# EAGLE design SMS with FM to Genesis INTEGRATED (EAGLE 6.5.0)
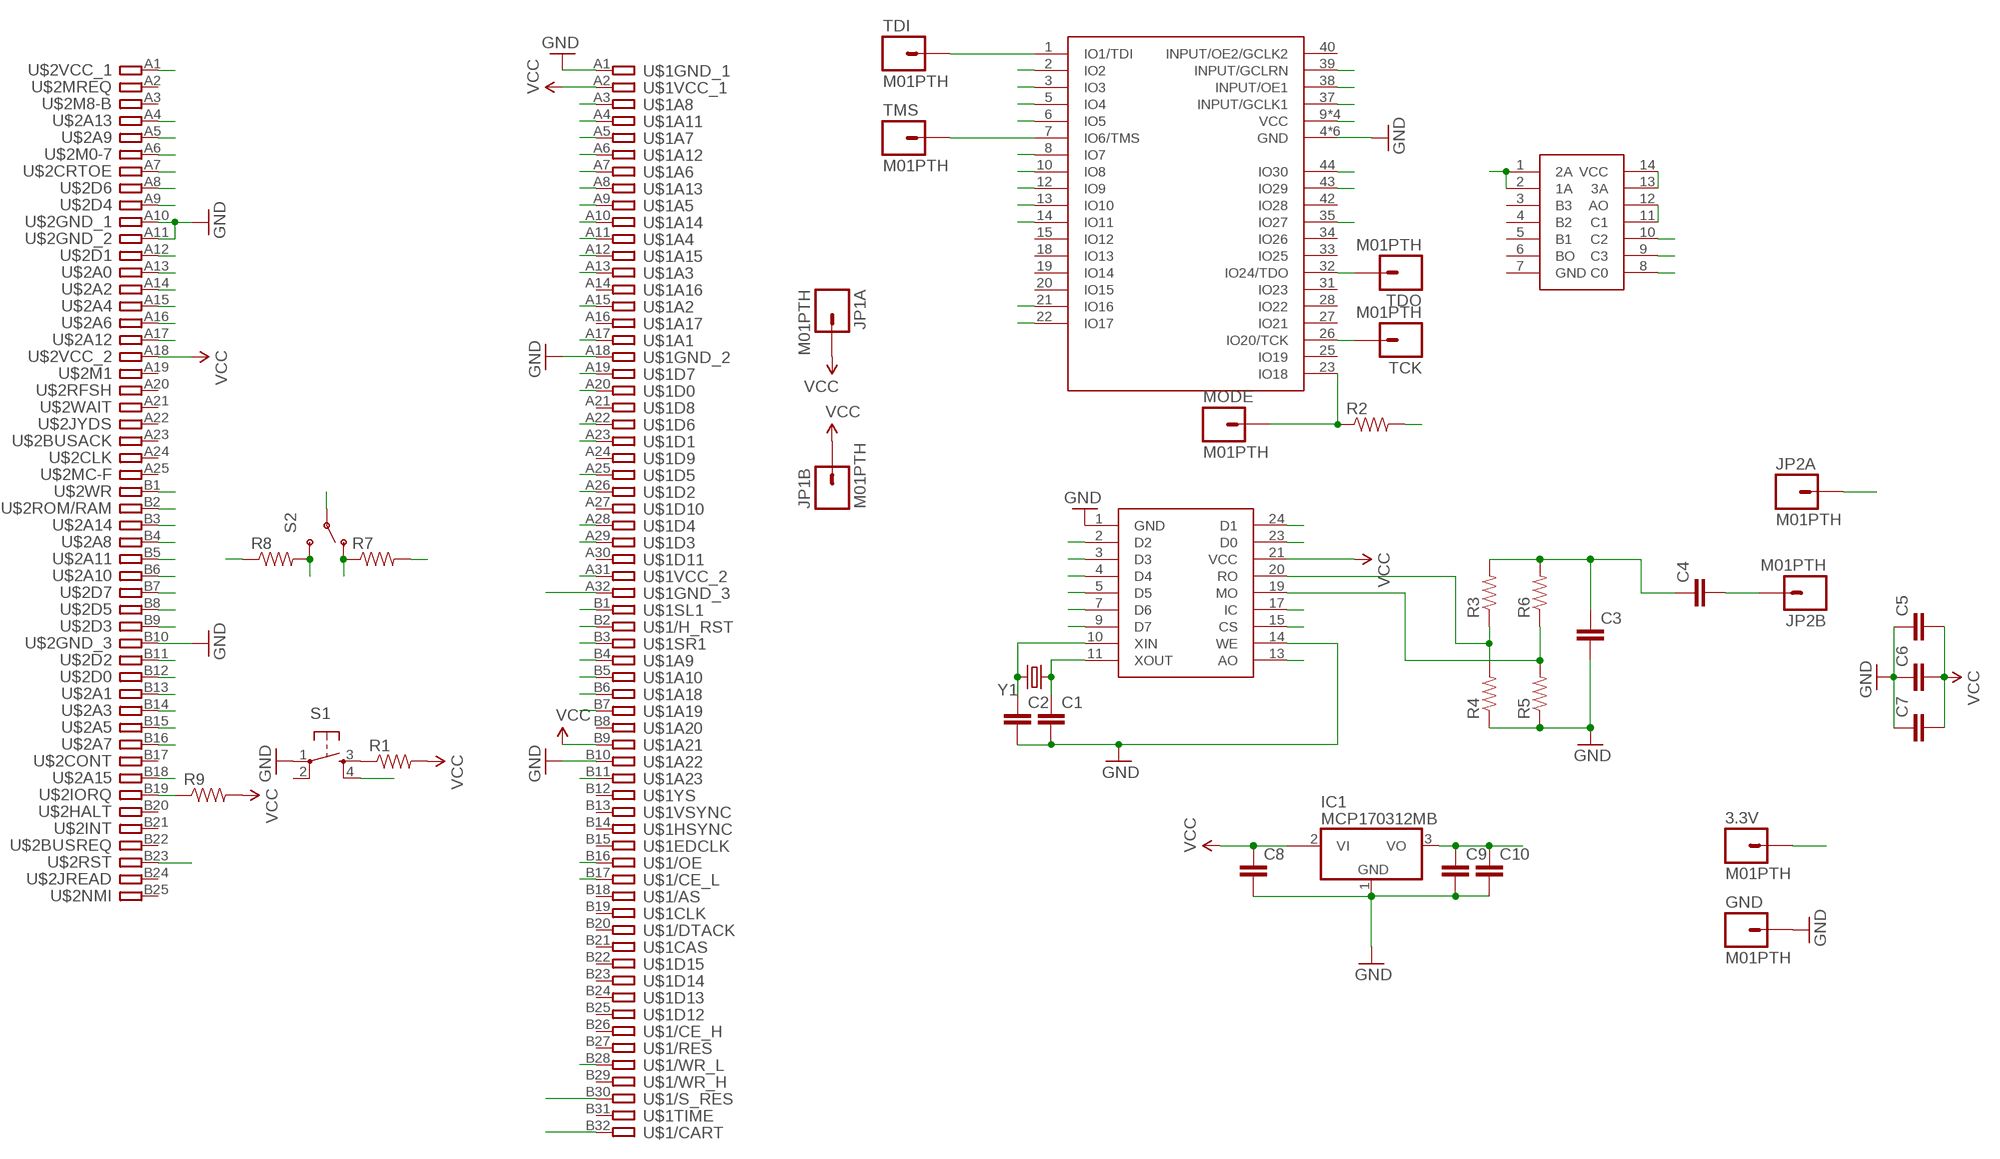
[diagram p0: schematic, sheet 1]

## Parts
3.3V  M01PTH  [1X01]
C1  CAP0805  [0805]
C2  CAP0805  [0805]
C3  CAP0805  [0805]
C4  CAP0805  [0805]
C5  CAP0805  [0805]
C6  CAP0805  [0805]
C7  CAP0805  [0805]
C8  CAP1206  [1206]
C9  CAP0805  [0805]
C10  CAP0805  [0805]
GND  M01PTH  [1X01]
IC1  MCP170312MB  [SOT89]
IC2  YM2413BSOIC24W  [SO24W]
IC3  74LS10SOIC14  [SO14]
JP1A  M01PTH  [1X01]
JP1B  M01PTH  [1X01]
JP2A  M01PTH  [1X01]
JP2B  M01PTH  [1X01]
MODE  M01PTH  [1X01]
R1  RESISTOR0805-RES  [0805]
R2  RESISTOR0805-RES  [0805]
R3  RESISTOR0805-RES  [0805]
R4  RESISTOR0805-RES  [0805]
R5  RESISTOR0805-RES  [0805]
R6  RESISTOR0805-RES  [0805]
R7  RESISTOR0805-RES  [0805]
R8  RESISTOR0805-RES  [0805]
R9  RESISTOR0805-RES  [0805]
S1  TAC_SWITCHSMD  [TACTILE-SWITCH-SMD]
S2  SWITCH-SPDTPTH  [SWITCH-SPDT]
TCK  M01PTH  [1X01]
TDI  M01PTH  [1X01]
TDO  M01PTH  [1X01]
TMS  M01PTH  [1X01]
U$1  GENESIS-LARGE  [GENESIS-LARGE]
U$2  SMS-R  [SMS]
U$4  EPM3032A  [TQFP44]
Y1  CRYSTALHC49US  [HC49US]

## Nets
3.3V: 3.3V.1 C9.1 C10.1 IC1.3(VO) R2.2 R7.2 R8.1 U$4.9(VCC) U$4.17(VCC) U$4.29(VCC) U$4.41(VCC)
A3: IC3.9(C3) U$1.A3 U$2.B16 U$4.44(IO30)
A4: U$1.A4 U$2.B6
A5: IC3.10(C2) U$1.A5 U$2.A16 U$4.3(IO3)
A6: U$1.A6 U$2.B5
A7: U$1.A7 U$2.B15
A8: U$1.A8 U$2.A17
A9: U$1.A9 U$2.A15
A10: U$1.A10 U$2.A4
A11: U$1.A11 U$2.B14
A12: U$1.A12 U$2.B3
A13: U$1.A13 U$2.A14 U$4.8(IO7)
A15: U$1.A15 U$2.B13 U$4.6(IO5)
A17: IC2.13(AO) U$1.A17 U$2.A13 U$4.14(IO11)
A19: IC2.9(D7) U$1.A19 U$2.B7
A20: IC2.23(D0) U$1.A20 U$2.B12 U$4.13(IO10)
A22: IC2.7(D6) U$1.A22 U$2.A8
A23: IC2.24(D1) U$1.A23 U$2.A12 U$4.12(IO9)
A25: IC2.5(D5) U$1.A25 U$2.B8
A26: IC2.2(D2) U$1.A26 U$2.B11 U$4.10(IO8)
A28: IC2.4(D4) U$1.A28 U$2.A9
A29: IC2.3(D3) U$1.A29 U$2.B9
A31: U$1.A31 U$2.A1
AUDOUT: JP2A.1 U$1.B1 U$1.B3
B2: U$1.B2
B4: U$1.B4 U$2.B4
B5: U$1.B5 U$2.A5
B6: U$1.B6 U$2.A7
B7: U$1.B7
B11: S1.4 U$1.B11
B16: U$1.B16 U$2.B2 U$4.5(IO4)
B17: U$1.B17 U$2.A6 U$2.B18
B28: U$1.B28 U$2.B1 U$4.2(IO2)
FM: R8.2 S2.3(S) U$4.35(IO27)
GND: C1.2 C2.2 C3.2 C5.1 C6.1 C7.1 C8.2 C9.2 C10.2 GND.1 IC1.1(GND) IC2.1(GND) IC2.14(WE) R4.1 R5.1 S1.1 U$1.A1 U$1.A18 U$1.B10 U$2.A10 U$2.A11 U$2.B10 U$4.4(GND) U$4.11(GND) U$4.16(GND) U$4.24(GND) U$4.30(GND) U$4.36(GND)
IORQ: IC3.1(2A) IC3.2(1A) R9.1 U$2.B19 U$4.43(IO29)
JPFM: R7.1 S2.1(O) U$4.37(INPUT/GCLK1)
KBSEL: IC3.8(C0) U$4.38(INPUT/OE1)
N$1: R1.1 S1.3
N$3: C2.1 IC2.10(XIN) Y1.2
N$4: C1.1 IC2.11(XOUT) Y1.1
N$5: TDI.1 U$4.1(IO1/TDI)
N$6: IC3.13(3A) IC3.14(VCC)
N$7: IC3.11(C1) IC3.12(AO)
N$8: TMS.1 U$4.7(IO6/TMS)
N$9: TDO.1 U$4.32(IO24/TDO)
N$10: TCK.1 U$4.26(IO20/TCK)
N$11: MODE.1 R2.1 U$4.23(IO18)
N$12: C3.1 C4.1 R3.2 R6.2
N$13: IC2.20(RO) R3.1 R4.2
N$14: IC2.19(MO) R5.2 R6.1
N$15: C4.2 JP2B.1
RST: U$2.B23 U$4.39(INPUT/GCLRN)
SMS: U$1.A32 U$1.B30 U$1.B32
TEMP: S2.2(P)
VCC: C5.2 C6.2 C7.2 C8.1 IC1.2@1(VI1) IC2.21(VCC) JP1A.1 JP1B.1 R1.2 R9.2 U$1.A2 U$1.B9 U$2.A18
YMCS: IC2.15(CS) U$4.22(IO17)
YMRESET: IC2.17(IC) U$4.21(IO16)
Unconnected: IC1.2(VI) IC3.3(B3) IC3.4(B2) IC3.5(B1) IC3.6(BO) S1.2 U$1.A14 U$1.A16 U$1.A21 U$1.A24 U$1.A27 U$1.A30 U$1.B8 U$1.B12 U$1.B13 U$1.B14 U$1.B15 U$1.B18 U$1.B19 U$1.B20 U$1.B21 U$1.B22 U$1.B23 U$1.B24 U$1.B25 U$1.B26 U$1.B27 U$1.B29 U$1.B31 U$2.A2 U$2.A3 U$2.A19 U$2.A20 U$2.A21 U$2.A22 U$2.A23 U$2.A24 U$2.A25 U$2.B17 U$2.B20 U$2.B21 U$2.B22 U$2.B24 U$2.B25 U$4.15(IO12) U$4.18(IO13) U$4.19(IO14) U$4.20(IO15) U$4.25(IO19) U$4.27(IO21) U$4.28(IO22) U$4.31(IO23) U$4.33(IO25) U$4.34(IO26) U$4.40(INPUT/OE2/GCLK2) U$4.42(IO28)

## Power pins joined to a net without a drawn wire
GND: IC3.7(GND)

## Library data of the parts
3.3V GND JP1A JP1B JP2A JP2B MODE TCK TDI TDO TMS = SparkFun-Connectors:M01: Header 1 Standard 1-pin 0.1" header. Use with straight break away headers (SKU : PRT-00116), right angle break away headers (PRT-00553), swiss pins (PRT-00743), machine pins (PRT-00117), and female headers (PRT-00115).
C1 C2 = SparkFun-Passives:CAP: Capacitor Standard 0603 ceramic capacitor, and 0.1" leaded capacitor.
C3-C10 = SparkFun-Capacitors:CAP: Capacitor Standard 0603 ceramic capacitor, and 0.1" leaded capacitor.
IC1 = linear:MCP1703*: 250 mA, 16V, Low Quiescent Current LDO Regulator Source: http://ww1.microchip.com/downloads/en/DeviceDoc/22049b.pdf
IC2 = linear:YM2413B
IC3 = linear:74LS10
R1-R9 = SparkFun-Passives:RESISTOR: Resistor Basic schematic elements and footprints for 0603, 1206, and PTH resistors.
S1 = SparkFun-Electromechanical:TAC_SWITCH: Momentary Switch Button commonly used for reset or general input. Spark Fun Electronics SKU : COM-00097 SMT- SWCH-08247
S2 = SparkFun-Electromechanical:SWITCH-SPDT: SPDT Switch Simple slide switch, Spark Fun Electronics SKU : COM-00102 DPDT SMT slide switch, AYZ0202, SWCH-08179
U$1 = genesis:GENESIS: Sega Genesis cartridge connector
U$2 = sms:SMS-R: Sega Master System cartridge connector, reversed
U$4 = linear:EPM3032A
Y1 = SparkFun-FreqCtrl:CRYSTAL: Various standard crystals. Proven footprints. Spark Fun Electronics SKU : COM-00534

## Board
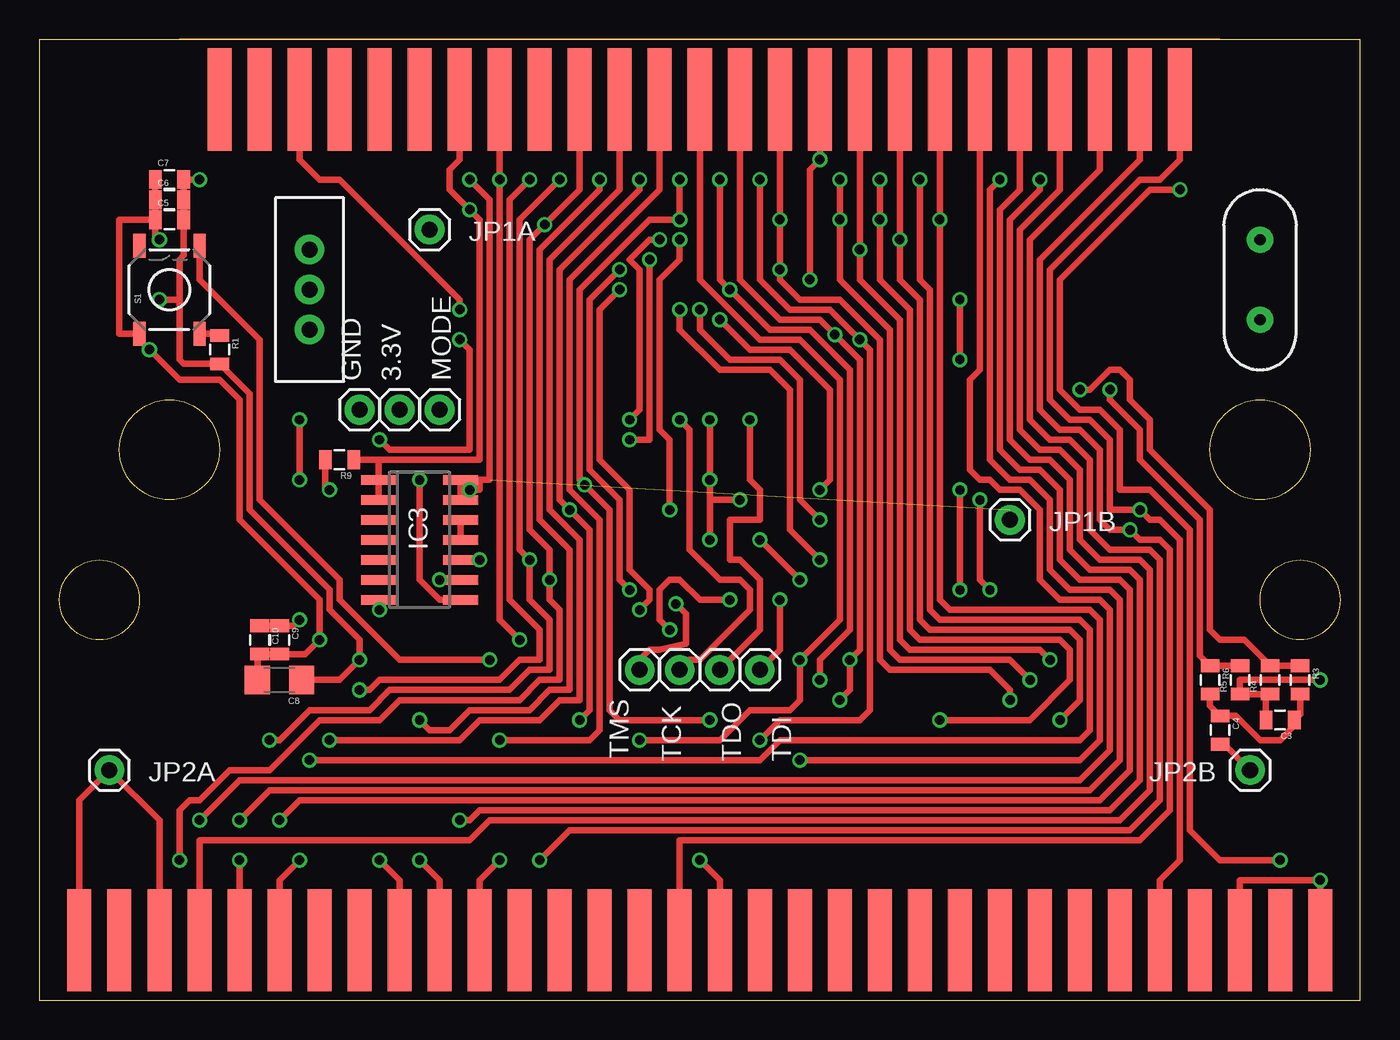
[diagram p1: board, top side]
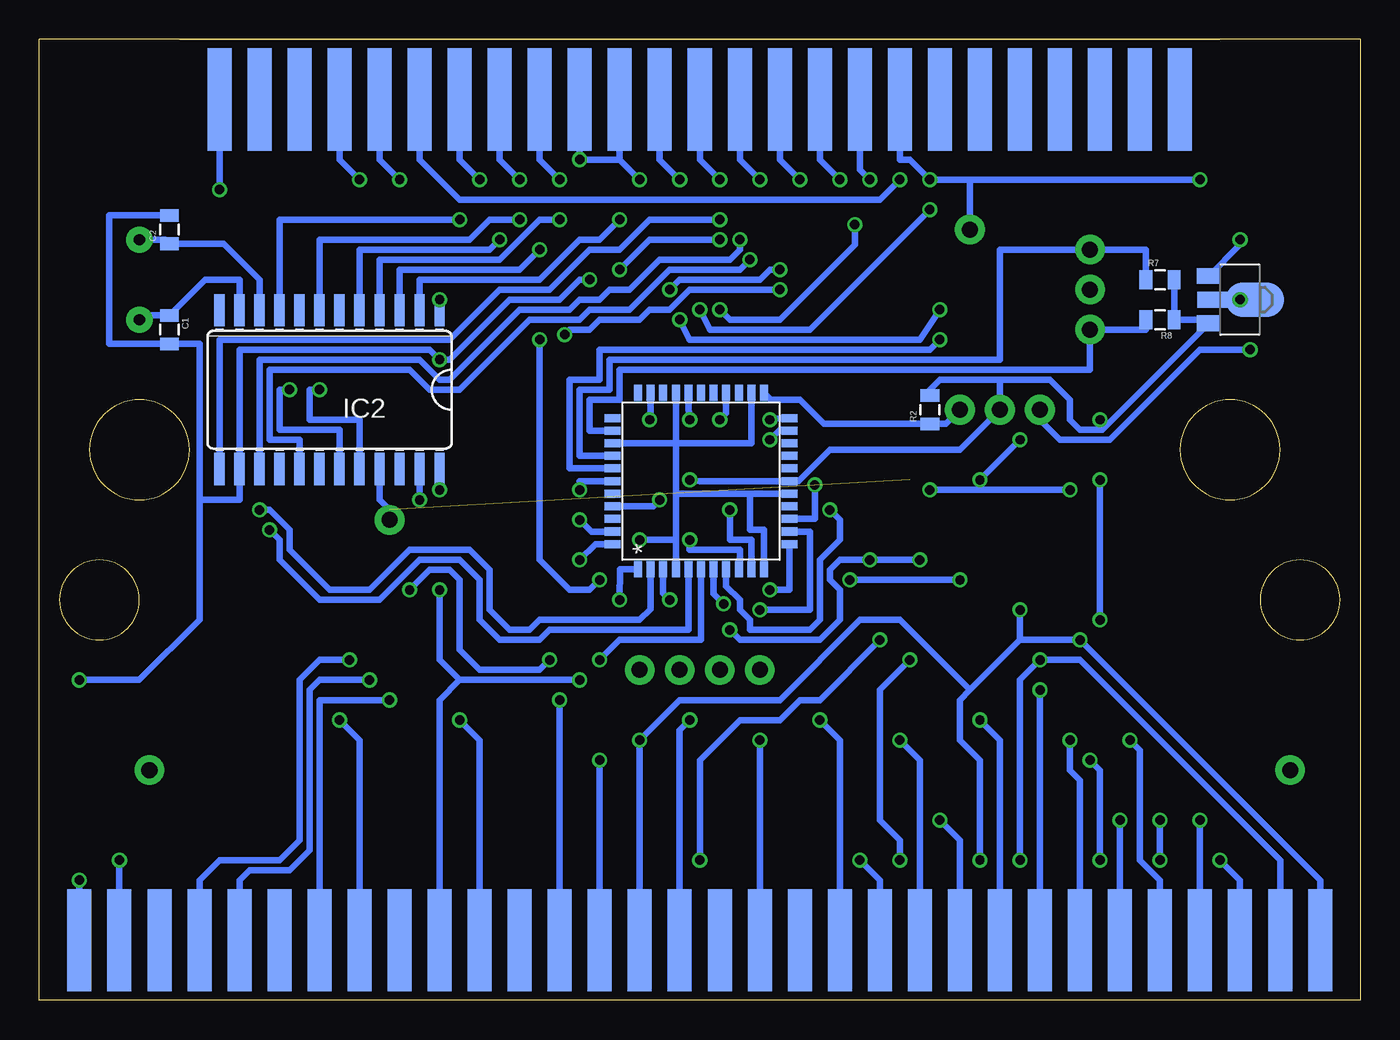
[diagram p2: board, bottom side, seen from below]

Size 83.82 x 60.96 mm. Coordinates in mm from the lower left corner, seen from the top.
Copper layers (1*16): Top 0.0356mm / dielectric 1.5011mm / Bottom 0.0356mm
Design rules "OSHPark": minimum track width 6mil, minimum drill 13mil, track to track 6mil, track to pad 6mil, pad to pad 6mil, via to via 6mil, smd to smd 6mil, copper to edge 15mil, drill to drill 6mil, minimum pad ring 7mil, minimum via ring 7mil, stop-mask expansion 3mil, vias tented up to drill 0mil, thermal gap 10mil

### Footprints (pad centres in the part's own frame; a part is rotated, then mirrored left to right if it is on the bottom)
1X01 = drill 1.016 pad 1.88: 1 0,0
0805 = smd 0.8 x 1.2: 1 -0.9,0; 2 0.9,0
1206 = smd 1.6 x 1.8: 1 -1.4,0; 2 1.4,0
SOT89 = smd 1 x 1.5: 1 -1.499,-1.981; 3 1.499,-1.981 | smd 1 x 2: 2 0,-1.727 | smd 2.2 x 3.7: 2@1 0,0.94
SO24W = smd 0.66 x 2.032: 1 -6.985,-5.029; 2 -5.715,-5.029; 3 -4.445,-5.029; 4 -3.175,-5.029; 5 -1.905,-5.029; 6 -0.635,-5.029; 7 0.635,-5.029; 8 1.905,-5.029; 9 3.175,-5.029; 10 4.445,-5.029; 11 5.715,-5.029; 12 6.985,-5.029; 13 6.985,5.029; 14 5.715,5.029; 15 4.445,5.029; 16 3.175,5.029; 17 1.905,5.029; 18 0.635,5.029; 19 -0.635,5.029; 20 -1.905,5.029; 21 -3.175,5.029; 22 -4.445,5.029; 23 -5.715,5.029; 24 -6.985,5.029
SO14 = smd 0.6 x 2.2: 1 -3.81,-2.6; 2 -2.54,-2.6; 3 -1.27,-2.6; 4 0,-2.6; 5 1.27,-2.6; 6 2.54,-2.6; 7 3.81,-2.6; 8 3.81,2.6; 9 2.54,2.6; 10 1.27,2.6; 11 0,2.6; 12 -1.27,2.6; 13 -2.54,2.6; 14 -3.81,2.6
TACTILE-SWITCH-SMD = smd 1.524 x 0.762: 1 -2.794,1.905; 2 2.794,1.905; 3 -2.794,-1.905; 4 2.794,-1.905
SWITCH-SPDT = drill 1.016 pad 1.88: 1 0,2.54; 2 0,0; 3 0,-2.54
GENESIS-LARGE = smd 1.524 x 6.477 bottom: A1 2.54,3.81; A2 5.08,3.81; A3 7.62,3.81; A4 10.16,3.81; A5 12.7,3.81; A6 15.24,3.81; A7 17.78,3.81; A8 20.32,3.81; A9 22.86,3.81; A10 25.4,3.81; A11 27.94,3.81; A12 30.48,3.81; A13 33.02,3.81; A14 35.56,3.81; A15 38.1,3.81; A16 40.64,3.81; A17 43.18,3.81; A18 45.72,3.81; A19 48.26,3.81; A20 50.8,3.81; A21 53.34,3.81; A22 55.88,3.81; A23 58.42,3.81; A24 60.96,3.81; A25 63.5,3.81; A26 66.04,3.81; A27 68.58,3.81; A28 71.12,3.81; A29 73.66,3.81; A30 76.2,3.81; A31 78.74,3.81; A32 81.28,3.81 | smd 1.524 x 6.477: B1 2.54,3.81; B2 5.08,3.81; B3 7.62,3.81; B4 10.16,3.81; B5 12.7,3.81; B6 15.24,3.81; B7 17.78,3.81; B8 20.32,3.81; B9 22.86,3.81; B10 25.4,3.81; B11 27.94,3.81; B12 30.48,3.81; B13 33.02,3.81; B14 35.56,3.81; B15 38.1,3.81; B16 40.64,3.81; B17 43.18,3.81; B18 45.72,3.81; B19 48.26,3.81; B20 50.8,3.81; B21 53.34,3.81; B22 55.88,3.81; B23 58.42,3.81; B24 60.96,3.81; B25 63.5,3.81; B26 66.04,3.81; B27 68.58,3.81; B28 71.12,3.81; B29 73.66,3.81; B30 76.2,3.81; B31 78.74,3.81; B32 81.28,3.81
SMS = smd 1.524 x 6.477 bottom: A1 2.54,3.81; A2 5.08,3.81; A3 7.62,3.81; A4 10.16,3.81; A5 12.7,3.81; A6 15.24,3.81; A7 17.78,3.81; A8 20.32,3.81; A9 22.86,3.81; A10 25.4,3.81; A11 27.94,3.81; A12 30.48,3.81; A13 33.02,3.81; A14 35.56,3.81; A15 38.1,3.81; A16 40.64,3.81; A17 43.18,3.81; A18 45.72,3.81; A19 48.26,3.81; A20 50.8,3.81; A21 53.34,3.81; A22 55.88,3.81; A23 58.42,3.81; A24 60.96,3.81; A25 63.5,3.81 | smd 1.524 x 6.477: B1 2.54,3.81; B2 5.08,3.81; B3 7.62,3.81; B4 10.16,3.81; B5 12.7,3.81; B6 15.24,3.81; B7 17.78,3.81; B8 20.32,3.81; B9 22.86,3.81; B10 25.4,3.81; B11 27.94,3.81; B12 30.48,3.81; B13 33.02,3.81; B14 35.56,3.81; B15 38.1,3.81; B16 40.64,3.81; B17 43.18,3.81; B18 45.72,3.81; B19 48.26,3.81; B20 50.8,3.81; B21 53.34,3.81; B22 55.88,3.81; B23 58.42,3.81; B24 60.96,3.81; B25 63.5,3.81
TQFP44 = smd 1.016 x 0.508: 1 -0.6,9; 2 -0.6,8.2; 3 -0.6,7.4; 4 -0.6,6.6; 5 -0.6,5.8; 6 -0.6,5; 7 -0.6,4.2; 8 -0.6,3.4; 9 -0.6,2.6; 10 -0.6,1.8; 11 -0.6,1; 23 10.6,1; 24 10.6,1.8; 25 10.6,2.6; 26 10.6,3.4; 27 10.6,4.2; 28 10.6,5; 29 10.6,5.8; 30 10.6,6.6; 31 10.6,7.4; 32 10.6,8.2; 33 10.6,9 | smd 0.508 x 1.016: 12 1,-0.6; 13 1.8,-0.6; 14 2.6,-0.6; 15 3.4,-0.6; 16 4.2,-0.6; 17 5,-0.6; 18 5.8,-0.6; 19 6.6,-0.6; 20 7.4,-0.6; 21 8.2,-0.6; 22 9,-0.6; 34 9,10.6; 35 8.2,10.6; 36 7.4,10.6; 37 6.6,10.6; 38 5.8,10.6; 39 5,10.6; 40 4.2,10.6; 41 3.4,10.6; 42 2.6,10.6; 43 1.8,10.6; 44 1,10.6
HC49US = drill 0.7 pad 1.651: 1 -2.54,0; 2 2.54,0

### Placement (x,y rotation side)
3.3V  22.86,37.47 0 top
C1  75.56,42.55 270 bottom
C2  75.56,48.9 90 bottom
C3  78.74,17.78 180 top
C4  74.93,17.14 270 top
C5  8.26,49.53 0 top
C6  8.26,50.8 0 top
C7  8.26,52.07 0 top
C8  15.24,20.32 180 top
C9  15.24,22.86 270 top
C10  13.97,22.86 270 top
GND  20.32,37.47 0 top
IC1  7.62,44.45 270 bottom
IC2  65.41,38.73 180 bottom
IC3  24.13,29.21 270 top
JP1A  24.77,48.9 0 top
JP1B  61.59,30.48 0 top
JP2A  4.45,14.61 270 top
JP2B  76.83,14.61 0 top
MODE  25.4,37.47 90 top
R1  11.43,41.27 270 top
R2  27.3,37.47 90 bottom
R3  80.01,20.32 270 top
R4  78.11,20.32 90 top
R5  76.2,20.32 90 top
R6  74.3,20.32 270 top
R7  12.7,45.72 0 bottom
R8  12.7,43.18 180 bottom
R9  19.05,34.29 180 top
S1  8.26,45.09 90 top
S2  17.14,45.09 0 top
TCK  40.64,20.95 0 top
TDI  45.72,20.95 0 top
TDO  43.18,20.95 0 top
TMS  38.1,20.95 0 top
U$1  0,0 0 top
U$2  74.93,60.96 180 top
U$4  36.83,27.94 90 bottom
Y1  77.47,45.72 90 top

### Tracks (layer width: path | path; a pad name or v marks a point on that pad's centre or on a via)
3.3V  (via drill 0.6)
  Top 0.406: v42.55,36.83 v42.55,33.02 | v42.55,33.02 v42.55,29.21 | v42.55,33.02 42.55,31.75 v44.45,31.75 | C10.1 C9.1 16.14,23.76 v16.51,24.13 | v16.51,33.02 v16.51,36.83
  Bottom 0.406: v42.55,36.83 42.63,37.55 U$4.29 | U$4.9 39.43,27.88 39.37,27.94 39.37,28.57 42.55,28.57 v42.55,29.21 | v42.55,33.02 41.91,32.94 U$4.17 35.64,32.94 33.66,34.92 25.4,34.92 3.3V.1 22.86,39.37 | U$4.41 44.86,31.34 v44.45,31.75 | 22.86,39.37 26.67,39.37 27.3,38.73 R2.2 | 16.12,36.44 16.36,36.2 17.78,36.2 18.41,36.83 18.41,38.1 19.68,39.37 22.86,39.37 | 16.12,36.44 IC1.3 9.6,43.18 R8.1 R7.2 | v16.51,24.13 v16.51,33.02 | v16.51,36.83 16.12,36.44
A3  (via drill 0.6)
  Top 0.406: v8.89,8.89 8.89,12.06 9.53,12.7 10.16,12.7 12.06,14.61 14.61,14.61 17.78,17.78 21.59,17.78 22.86,19.05 30.48,19.05 31.75,20.32 33.02,20.32 33.02,24.77 32.38,25.4 v32.38,26.67 32.38,28.57 31.11,29.84 31.11,48.26 v32.07,49.21 34.29,51.44 U$2.B16 | v25.4,26.67 IC3.9 | v49.53,27.94 47.62,29.84 47.62,38.73 46.35,40.01 43.18,40.01 40.64,42.55 v40.64,43.81
  Bottom 0.406: v8.89,8.89 7.62,7.62 U$1.A3 | v32.38,26.67 v25.4,26.67 | U$4.44 48.53,28.94 v49.53,27.94 | v40.64,43.81 40.01,43.18 36.83,43.18 32.07,47.94 v32.07,49.21
A4  (via drill 0.6)
  Top 0.406: v10.16,11.43 12.7,13.97 66.04,13.97 67.94,15.88 67.94,24.77 67.31,25.4 64.77,25.4 63.5,26.67 63.5,31.11 62.23,32.38 60.96,32.38 60.33,33.02 59.69,33.02 59.05,33.66 59.05,39.37 59.69,40.01 U$2.B6
  Bottom 0.406: v10.16,11.43 U$1.A4
A5  (via drill 0.6)
  Top 0.406: v14.61,16.51 15.24,16.51 17.14,18.41 20.95,18.41 22.23,19.68 29.84,19.68 31.11,20.95 32.38,20.95 32.38,24.13 31.11,25.4 v31.11,27.94 30.48,28.57 30.48,49.53 v33.02,52.07 | v27.94,27.94 IC3.10 | v43.81,25.4 41.91,25.4 40.64,26.67 40.01,26.67 39.37,26.04 39.37,24.13 v40.01,23.5
  Bottom 0.406: U$2.A16 34.29,53.34 v33.02,52.07 | v14.61,16.51 13.97,15.88 13.97,8.89 12.7,7.62 U$1.A5 | v27.94,27.94 v31.11,27.94 33.02,27.94 33.66,27.3 33.66,26.67 33.02,26.04 33.02,24.13 34.29,22.86 39.37,22.86 v40.01,23.5 | U$4.3 44.23,25.82 v43.81,25.4
A6  (via drill 0.6)
  Top 0.406: v15.24,11.43 16.51,12.7 67.31,12.7 69.22,14.61 69.22,26.04 68.58,26.67 66.04,26.67 64.77,27.94 64.77,32.38 63.5,33.66 62.23,33.66 60.96,34.92 60.96,50.16 62.23,51.44 U$2.B5
  Bottom 0.406: v15.24,11.43 U$1.A6
A7  (via drill 0.6)
  Top 0.406: v18.41,16.51 26.67,16.51 27.94,17.78 31.75,17.78 33.02,19.05 34.29,19.05 34.29,29.21 32.38,31.11 32.38,46.99 36.83,51.44 U$2.B15
  Bottom 0.406: U$1.A7 17.78,13.97 18.41,14.61 v18.41,16.51
A8  (via drill 0.6)
  Top 0.406: v20.32,19.68 20.95,19.68 21.59,20.32 29.21,20.32 30.48,21.59 31.75,21.59 31.75,23.5 29.84,25.4 29.84,50.8 v31.11,52.07
  Bottom 0.406: U$2.A17 31.75,52.7 v31.11,52.07 | v20.32,19.68 U$1.A8
A9  (via drill 0.6)
  Top 0.406: v24.13,17.78 24.77,17.14 26.04,17.14 27.3,18.41 31.11,18.41 32.38,19.68 33.66,19.68 33.66,28.57 31.75,30.48 31.75,47.62 35.56,51.44 v35.56,52.07
  Bottom 0.406: U$2.A15 36.83,53.34 v35.56,52.07 | v24.13,17.78 22.86,16.51 U$1.A9
A10  (via drill 0.6)
  Top 0.406: v26.67,11.43 27.3,11.43 27.94,12.06 67.94,12.06 69.85,13.97 69.85,26.67 69.22,27.3 66.67,27.3 65.41,28.57 65.41,33.02 64.14,34.29 62.87,34.29 61.59,35.56 61.59,49.53 63.5,51.44 v63.5,52.07
  Bottom 0.406: U$1.A10 25.4,10.16 v26.67,11.43 | v63.5,52.07 64.77,53.34 U$2.A4
A11  (via drill 0.6)
  Top 0.406: v29.21,16.51 34.92,16.51 35.56,17.14 35.56,30.48 33.66,32.38 33.66,45.72 39.37,51.44 U$2.B14
  Bottom 0.406: v29.21,16.51 27.94,15.24 U$1.A11
A12  (via drill 0.6)
  Top 0.406: v31.75,8.89 33.66,10.79 69.22,10.79 71.12,12.7 71.12,27.94 70.48,28.57 67.94,28.57 66.67,29.84 66.67,34.29 65.41,35.56 64.14,35.56 62.87,36.83 62.87,48.26 67.31,52.7 U$2.B3
  Bottom 0.406: v31.75,8.89 30.48,7.62 U$1.A12
A13  (via drill 0.6)
  Top 0.406: v34.29,17.78 34.92,18.41 34.92,29.84 v33.66,31.11 33.02,31.75 33.02,46.35 38.1,51.44 v38.1,52.07
  Bottom 0.406: U$2.A14 39.37,53.34 v38.1,52.07 | v34.29,17.78 33.02,16.51 U$1.A13 | v33.66,31.11 33.02,30.48 33.02,29.21 34.29,27.94 34.29,24.13 34.92,23.5 38.73,23.5 38.73,24.13 39.37,24.77 39.37,25.4 40.23,26.26 U$4.8
A15  (via drill 0.6)
  Top 0.406: v38.1,16.51 43.18,16.51 45.09,18.41 47.62,18.41 48.26,19.05 v48.26,21.59 50.8,24.13 50.8,39.37 48.26,41.91 45.72,41.91 41.91,45.72 U$2.B13
  Bottom 0.406: v38.1,16.51 U$1.A15 | U$4.6 41.83,22.86 46.99,22.86 v48.26,21.59
A17  (via drill 0.6)
  Top 0.406: v40.64,52.07 v40.64,49.53 38.73,49.53 34.29,45.09 34.29,33.02 v34.61,32.7 36.2,31.11 36.2,18.41 36.83,17.78 v42.55,17.78
  Bottom 0.406: U$2.A13 41.91,53.34 v40.64,52.07 | v42.55,17.78 43.18,17.14 U$1.A17 | IC2.13 72.39,41.91 57.78,41.91 54.61,45.09 51.44,45.09 48.9,47.62 46.99,47.62 45.09,49.53 v40.64,49.53 | U$4.14 34.61,30.54 v34.61,32.7
A19  (via drill 0.6)
  Top 0.406: v48.26,15.24 66.04,15.24 67.31,16.51 67.31,24.13 66.67,24.77 57.78,24.77 57.15,25.4 v57.15,49.53 U$2.B7
  Bottom 0.406: v48.26,15.24 U$1.A19 | IC2.9 68.58,49.53 v57.15,49.53
A20  (via drill 0.6)
  Top 0.406: U$2.B12 44.45,45.72 46.99,43.18 49.53,43.18 v50.48,42.23 52.07,40.64 52.07,22.23 v51.44,21.59 51.44,19.68 v50.8,19.05 | v38.1,24.77 38.73,25.4 38.73,26.04 37.47,27.3 37.47,32.38 35.56,34.29 35.56,43.81 v36.83,45.09 | v59.69,31.75 59.69,26.67 v60.33,26.04
  Bottom 0.406: v50.8,19.05 U$1.A20 | v51.44,21.59 52.07,20.95 55.88,20.95 57.15,22.23 57.15,26.67 57.78,27.3 59.05,27.3 v60.33,26.04 | U$4.13 34.92,29.74 34.92,24.77 v38.1,24.77 | v36.83,45.09 42.55,45.09 43.81,43.81 45.09,43.81 45.72,43.18 48.26,43.18 48.9,42.55 50.16,42.55 v50.48,42.23 | IC2.23 v59.69,31.75
A22  (via drill 0.6)
  Top 0.406: v57.15,17.78 62.87,17.78 65.41,20.32 65.41,22.23 64.77,22.86 55.88,22.86 55.24,23.5 55.24,43.81 53.34,45.72 v53.34,49.53 v53.34,52.07
  Bottom 0.406: U$2.A8 54.61,53.34 v53.34,52.07 | v57.15,17.78 55.88,16.51 U$1.A22 | IC2.7 66.04,48.26 56.52,48.26 55.24,49.53 v53.34,49.53
A23  (via drill 0.6)
  Top 0.406: v58.42,32.38 v58.42,26.04 | v43.18,52.07 43.18,45.72 v43.81,45.09 46.35,42.55 48.9,42.55 51.44,40.01 51.44,23.5 49.53,21.59 v49.53,20.32 | v37.47,26.04 36.83,26.67 36.83,31.75 34.92,33.66 34.92,44.45 v36.83,46.35
  Bottom 0.406: U$2.A12 44.45,53.34 v43.18,52.07 | U$1.A23 58.42,19.05 57.15,20.32 | 57.15,20.32 v49.53,20.32 | IC2.24 v58.42,32.38 | v58.42,26.04 58.42,21.59 57.15,20.32 | U$4.12 36.23,26.04 v37.47,26.04 | v36.83,46.35 37.47,46.35 38.1,45.72 43.18,45.72 v43.81,45.09
A25  (via drill 0.6)
  Top 0.406: v64.77,17.78 66.04,19.05 66.04,22.86 65.41,23.5 56.52,23.5 55.88,24.13 55.88,44.45 54.61,45.72 v54.61,48.26 U$2.B8
  Bottom 0.406: v64.77,17.78 63.5,16.51 U$1.A25 | IC2.5 63.5,47.62 55.24,47.62 v54.61,48.26
A26  (via drill 0.6)
  Top 0.406: U$2.B11 v46.99,49.53 v46.99,46.35 46.99,45.72 48.26,44.45 50.8,44.45 53.34,41.91 53.34,21.59 53.98,20.95 60.33,20.95 61.59,19.68 v61.59,19.05 | v40.01,31.11 40.01,35.56 39.37,36.2 39.37,45.72 40.64,46.99 v40.64,48.26
  Bottom 0.406: U$1.A26 66.04,19.05 v61.59,19.05 | v46.99,49.53 48.26,48.26 49.53,48.26 52.07,45.72 59.69,45.72 IC2.2 | v40.64,48.26 45.09,48.26 v46.99,46.35 | U$4.10 38.63,29.21 40.01,29.21 v40.01,31.11
A28  (via drill 0.6)
  Top 0.406: v50.8,52.07 v50.8,49.53 50.8,45.72 53.98,42.55 53.98,22.23 54.61,21.59 61.59,21.59 v62.87,20.32
  Bottom 0.406: U$2.A9 52.07,53.34 v50.8,52.07 | U$1.A28 71.12,7.62 70.48,8.26 67.94,8.26 66.67,9.53 66.67,19.68 66.04,20.32 v62.87,20.32 | IC2.4 62.23,46.99 54.61,46.99 52.07,49.53 v50.8,49.53
A29  (via drill 0.6)
  Top 0.406: U$2.B9 v52.07,47.62 52.07,45.72 54.61,43.18 54.61,22.86 55.24,22.23 63.5,22.23 v64.14,21.59
  Bottom 0.406: U$1.A29 73.66,7.62 72.39,8.89 68.58,8.89 67.31,10.16 67.31,20.32 66.04,21.59 v64.14,21.59 | IC2.3 60.96,46.35 53.34,46.35 v52.07,47.62
A31  (via drill 0.6)
  Top 0.406: v78.74,8.89 74.93,8.89 73.03,10.79 73.03,29.84 70.48,32.38 68.58,32.38 68.58,36.2 67.31,37.47 66.04,37.47 64.77,38.73 64.77,45.72 70.48,51.44 v72.39,51.44
  Bottom 0.406: v78.74,8.89 U$1.A31 | U$2.A1 v72.39,51.44
AUDOUT
  Top 0.406: U$1.B1 2.54,12.7 JP2A.1 7.62,11.43 U$1.B3
B4
  Top 0.406: U$1.B4 10.16,10.16 27.3,10.16 28.57,11.43 68.58,11.43 70.48,13.34 70.48,27.3 69.85,27.94 67.31,27.94 66.04,29.21 66.04,33.66 64.77,34.92 63.5,34.92 62.23,36.2 62.23,48.9 64.77,51.44 U$2.B4
B5  (via drill 0.6)
  Top 0.406: v12.7,11.43 14.61,13.34 66.67,13.34 68.58,15.24 68.58,25.4 67.94,26.04 65.41,26.04 64.14,27.3 64.14,31.75 62.87,33.02 61.59,33.02 60.33,34.29 60.33,51.44 v60.96,52.07 | v12.7,8.89 U$1.B5
  Bottom 0.406: U$2.A5 62.23,53.34 v60.96,52.07 | v12.7,11.43 v12.7,8.89
B6  (via drill 0.6)
  Top 0.406: v17.14,15.24 45.72,15.24 46.99,16.51 66.04,16.51 66.67,17.14 66.67,23.5 66.04,24.13 57.15,24.13 56.52,24.77 56.52,45.09 55.88,45.72 v55.88,52.07 | v16.51,8.89 15.24,7.62 U$1.B6
  Bottom 0.406: U$2.A7 57.15,53.34 v55.88,52.07 | v16.51,8.89 16.51,14.61 v17.14,15.24
B11  (via drill 0.6)
  Top 0.406: v29.21,8.89 27.94,7.62 U$1.B11 | v28.57,21.59 22.86,21.59 19.05,25.4 19.05,26.67 13.97,31.75 13.97,41.91 10.16,45.72 S1.4
  Bottom 0.406: v28.57,21.59 30.48,19.68 30.48,11.43 29.21,10.16 v29.21,8.89
B16  (via drill 0.6)
  Top 0.406: U$2.B2 69.85,53.34 63.5,46.99 63.5,37.47 64.77,36.2 66.04,36.2 67.31,34.92 67.31,30.48 67.94,29.84 v69.22,29.84 69.85,29.21 71.12,29.21 71.75,28.57 71.75,12.06 69.85,10.16 40.64,10.16 U$1.B16
  Bottom 0.406: U$4.5 42.63,23.5 51.44,23.5 52.07,22.86 54.61,22.86 55.88,24.13 55.88,26.67 57.15,27.94 59.69,27.94 62.23,25.4 66.04,25.4 68.58,27.94 68.58,29.21 v69.22,29.84
B17  (via drill 0.6)
  Top 0.406: U$1.B17 43.18,7.62 v41.91,8.89 | U$2.B18 v29.21,52.07 29.21,24.13 v30.48,22.86
  Bottom 0.406: v29.21,52.07 30.48,50.8 57.15,50.8 59.69,53.34 U$2.A6 | v41.91,8.89 41.91,15.24 39.37,17.78 36.83,17.78 35.56,19.05 34.29,19.05 v30.48,22.86
B28  (via drill 0.6)
  Top 0.406: U$1.B28 71.12,7.62 72.39,8.89 72.39,29.21 71.12,30.48 70.48,30.48 v69.85,31.11 67.94,31.11 67.94,35.56 66.67,36.83 65.41,36.83 64.14,38.1 64.14,46.35 69.85,52.07 71.12,52.07 72.39,53.34 U$2.B1
  Bottom 0.406: U$4.2 45.03,24.82 45.72,24.13 52.07,24.13 52.7,23.5 53.98,23.5 55.24,24.77 55.24,27.3 56.52,28.57 60.33,28.57 62.87,26.04 65.41,26.04 67.94,28.57 67.94,29.84 69.22,31.11 v69.85,31.11
FM
  Bottom 0.406: U$4.35 48.9,36.14 48.9,38.1 46.99,38.1 46.99,40.01 17.14,40.01 S2.3 13.6,42.55 R8.2
GND  (via drill 0.6)
  Top 0.406: U$2.B10 v49.53,53.34 48.9,52.7 v48.9,45.72 | v45.72,16.51 46.99,17.78 52.07,17.78 52.7,18.41 52.7,41.27 v52.07,41.91 50.16,43.81 47.62,43.81 45.72,45.72 v45.72,52.07 | U$1.B10 25.4,7.62 v24.13,8.89 | v58.42,44.45 v58.42,40.64 | IC3.7 21.59,25.34 v21.59,24.77 | C3.2 77.84,19.16 R4.1 R5.1 76.2,20.32 v81.28,20.32 | C7.1 C6.1 C5.1 | v48.26,26.67 v45.72,29.21 | C5.1 5.08,49.53 5.08,42.29 S1.1 6.35,41.91 v6.99,41.27 8.89,39.37 11.43,39.37 12.7,38.1 12.7,30.48 17.78,25.4 v17.78,22.86 16.88,21.96 C9.2 C10.2 13.84,21.83 C8.2 | v7.62,48.26 7.36,48.52 C5.1
  Bottom 0.406: 46.99,53.34 v49.53,53.34 U$2.B10 | U$2.A11 46.99,53.34 | v45.72,52.07 46.99,53.34 | v24.13,8.89 24.13,15.24 25.4,16.51 25.4,19.05 24.77,19.68 | 21.59,22.86 v17.78,22.86 2.54,7.62 U$1.A1 | 21.59,22.86 24.77,19.68 | U$1.A18 v45.72,16.51 43.18,19.05 36.83,19.05 31.75,24.13 29.21,24.13 24.77,19.68 | C2.2 79.38,49.8 79.38,41.65 C1.2 73.66,41.65 73.66,31.75 | 73.66,31.75 71.12,31.75 IC2.14 71.12,41.27 59.05,41.27 v58.42,40.64 57.78,40.64 53.98,44.45 50.8,44.45 49.53,45.72 v48.9,45.72 | IC2.1 v58.42,44.45 | v21.59,24.77 21.59,22.86 | U$4.16 38.73,32.14 | 38.73,32.14 43.43,32.14 | 38.63,37.57 U$4.24 38.63,35.34 43.43,35.34 | U$4.4 43.43,29.21 | 43.43,29.21 43.43,32.14 | U$4.36 43.43,35.34 | 43.43,35.34 U$4.30 | 43.43,35.34 43.43,32.14 | U$4.11 37.83,29.84 38.73,29.84 38.73,32.14 | v81.28,20.32 77.47,20.32 73.66,24.13 73.66,31.75 | v52.07,41.91 52.07,27.94 50.16,26.04 48.9,26.04 v48.26,26.67 | v45.72,29.21 43.43,29.21 | IC1.1 7.62,47.93 v7.62,48.26 | v6.99,41.27 10.16,41.27 15.88,35.56 19.05,35.56 20.32,36.83 GND.1
IORQ  (via drill 0.6)
  Top 0.406: IC3.2 IC3.1 21.53,34.29 | 21.53,34.29 21.59,34.29 27.94,34.29 27.94,49.53 v27.3,50.16 26.04,51.44 26.04,52.7 26.67,53.34 U$2.B19 | v49.53,30.48 48.26,31.75 48.26,39.37 46.99,40.64 43.81,40.64 41.91,42.55 v41.91,43.81 | R9.1 21.53,34.29
  Bottom 0.406: U$4.43 48.79,29.74 v49.53,30.48 | v41.91,43.81 41.27,42.55 34.92,42.55 v27.3,50.16
JPFM
  Bottom 0.406: U$4.37 49.53,34.54 49.53,38.73 47.62,38.73 47.62,40.64 22.86,40.64 22.86,47.62 S2.1 13.6,47.62 R7.1
KBSEL  (via drill 0.6)
  Top 0.406: v26.67,41.91 27.3,41.27 27.3,34.92 22.23,34.92 v21.59,35.56 | v24.13,33.02 24.13,26.67 25.4,25.4 IC3.8
  Bottom 0.406: U$4.38 50.16,33.74 50.16,39.37 48.26,39.37 48.26,41.27 27.3,41.27 v26.67,41.91 | v21.59,35.56 v24.13,33.02
N$1
  Top 0.406: R1.1 11.31,42.29 S1.3
N$3
  Bottom 0.406: IC2.10 69.85,45.72 72.12,47.99 C2.1 75.83,48.26 Y1.2
N$4
  Bottom 0.406: IC2.11 71.12,45.72 73.29,45.72 C1.1 77.47,43.45 Y1.1
N$5  (via drill 0.6)
  Top 0.406: v46.99,25.4 46.99,22.23 TDI.1
  Bottom 0.406: U$4.1 46.95,27.34 v46.99,25.4
N$6
  Top 0.406: IC3.14 IC3.13
N$7
  Top 0.406: IC3.12 IC3.11
N$8  (via drill 0.6)
  Top 0.406: TMS.1 38.1,21.59 38.73,22.23 39.37,22.23 41.03,22.61 41.03,24.52 v40.4,25.16
  Bottom 0.406: U$4.7 41.03,25.79 v40.4,25.16
N$9  (via drill 0.6)
  Top 0.406: TDO.1 45.72,23.5 45.72,26.67 44.45,27.94 43.81,27.94 43.81,30.48 45.72,30.48 45.72,32.38 45.09,33.02 v45.09,36.83
  Bottom 0.406: U$4.32 45.03,37.41 v45.09,36.83
N$10  (via drill 0.6)
  Top 0.406: v40.64,36.83 41.27,36.2 41.27,28.57 43.18,26.67 44.45,26.67 45.09,26.04 45.09,24.77 41.91,21.59 41.27,21.59 TCK.1
  Bottom 0.406: U$4.26 40.23,37.24 v40.64,36.83
N$11
  Bottom 0.406: MODE.1 26.3,36.56 R2.1 34.02,36.56 35.56,38.1 37.39,38.1 U$4.23
N$12
  Top 0.406: R3.2 80.01,18.15 C3.1 79.64,17.41 78.74,16.51 77.47,16.51 75.94,18.05 C4.1 74.3,18.68 R6.2
N$13  (via drill 0.6)
  Top 0.406: v66.04,38.73 66.67,38.73 67.94,40.01 68.58,40.01 69.22,39.37 69.22,38.1 70.48,36.83 70.48,34.92 74.3,31.11 74.3,23.5 74.93,22.86 76.47,22.86 R4.2 R3.1
  Bottom 0.406: IC2.20 63.5,36.83 66.67,36.83 66.67,38.73 v66.04,38.73
N$14  (via drill 0.6)
  Top 0.406: v67.94,38.73 67.94,38.1 69.85,36.2 69.85,34.29 73.66,30.48 73.66,21.86 R6.1 R5.2
  Bottom 0.406: IC2.19 64.77,36.2 68.58,36.2 68.58,38.73 v67.94,38.73
N$15
  Top 0.406: C4.2 75.19,16.25 JP2B.1
RST  (via drill 0.6)
  Top 0.406: v49.53,32.38 50.16,33.02 50.16,38.73 47.62,41.27 45.09,41.27 v43.18,43.18 | v26.67,43.81 26.67,44.45 19.05,52.07 17.78,52.07 16.51,53.34 U$2.B23
  Bottom 0.406: U$4.39 49.53,32.94 v49.53,32.38 | v43.18,43.18 42.55,41.91 27.94,41.91 v26.67,43.81
SMS  (via drill 0.6)
  Top 0.406: U$1.B30 76.2,7.62 v81.28,7.62 U$1.B32
  Bottom 0.406: U$1.B32 v81.28,7.62
VCC  (via drill 0.6)  (1 unrouted)
  Top 0.406: v21.59,8.89 22.86,7.62 U$1.B9 | 27.94,51.44 v27.3,52.07 28.57,50.8 28.57,33.02 27.94,33.02 | v10.16,52.07 C7.2 C6.2 C5.2 9.15,47.26 8.89,46.99 8.89,44.45 | 8.89,44.45 8.89,40.64 9.15,40.38 R1.2 13.34,38.47 13.34,31.11 18.41,26.04 18.41,24.77 20.32,22.86 v20.32,21.59 19.05,20.32 C8.1 | 8.89,44.45 v7.62,44.45 | 27.94,33.02 26.67,33.02 | R9.2 18.15,32.38 v18.41,32.38 | v27.3,32.38 27.94,32.38 27.94,33.02
  Bottom 0.406: U$2.A18 29.21,53.34 28.57,53.34 v27.3,52.07 24.77,52.07 | v21.59,8.89 21.59,20.32 v20.32,21.59 17.78,21.59 5.08,8.89 U$1.A2 | 24.77,52.07 v10.16,52.07 | JP1A.1 24.77,52.07 | JP1B.1 61.59,31.11 62.23,31.75 IC2.21 | v7.62,44.45 IC1.2@1 | v18.41,32.38 v27.3,32.38
YMCS  (via drill 0.6)
  Top 0.406: v39.37,48.26 38.73,48.26 37.47,46.99 38.1,46.35 38.1,37.47 v37.47,36.83
  Bottom 0.406: v39.37,48.26 39.37,47.62 40.01,46.99 44.45,46.99 46.35,45.09 47.62,45.09 48.26,44.45 49.53,44.45 50.16,43.81 53.34,43.81 57.78,39.37 58.42,39.37 59.69,40.64 69.85,40.64 IC2.15 | U$4.22 36.83,36.94 v37.47,36.83
YMRESET  (via drill 0.6)
  Top 0.406: v37.47,35.56 38.73,35.56 v38.73,46.99
  Bottom 0.406: v38.73,46.99 39.37,46.35 43.81,46.35 46.35,43.81 48.9,43.81 49.53,43.18 52.7,43.18 57.15,38.73 59.05,38.73 60.33,40.01 69.22,40.01 69.22,35.56 67.31,35.56 IC2.17 | U$4.21 36.77,36.14 36.83,36.2 v37.47,35.56